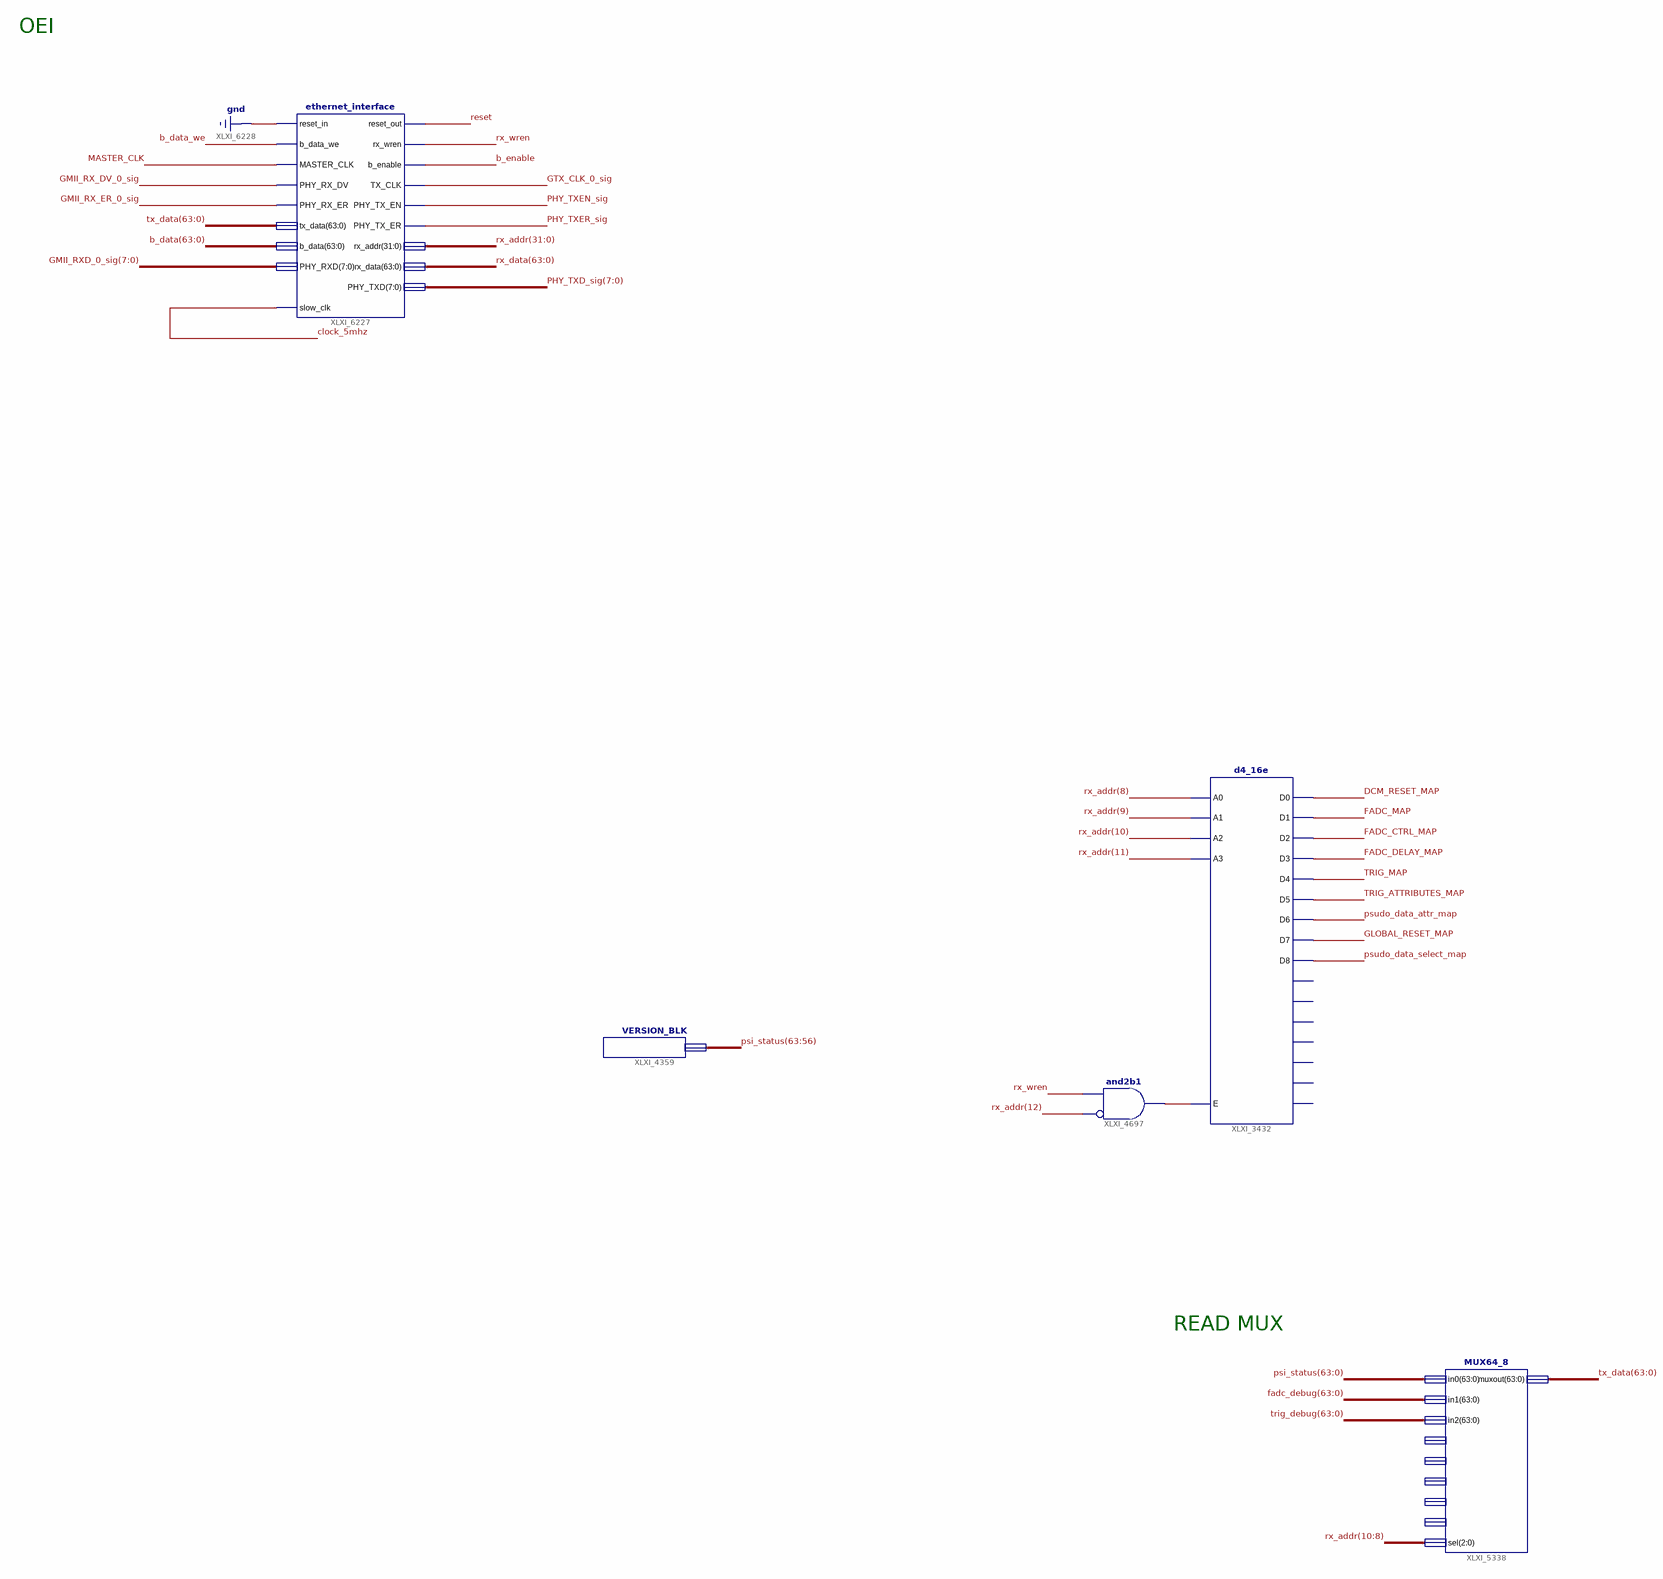
[diagram p0: schematic sheet 1]
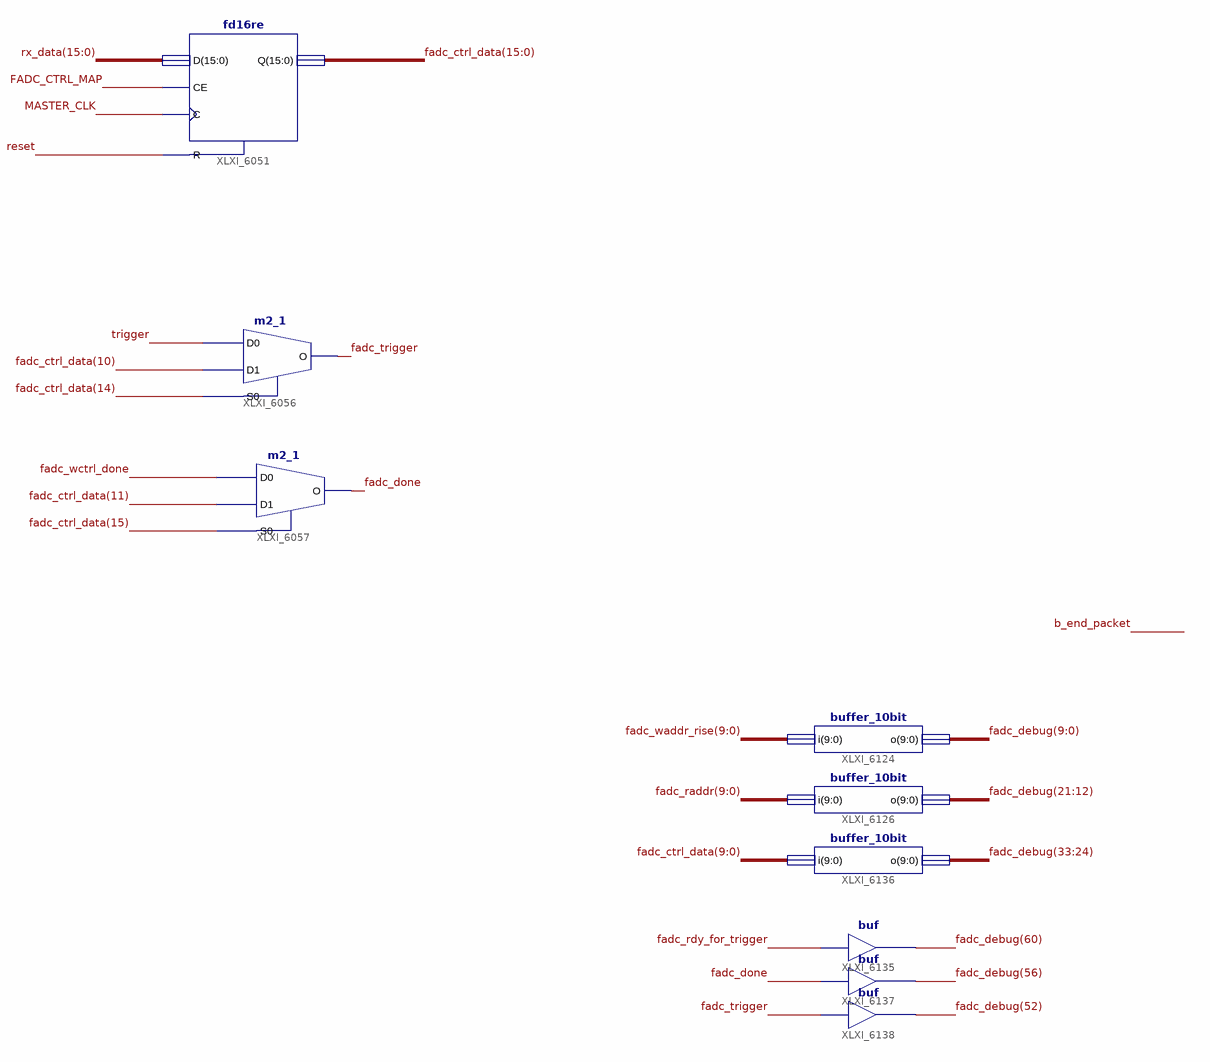
[diagram p1: schematic sheet 2]
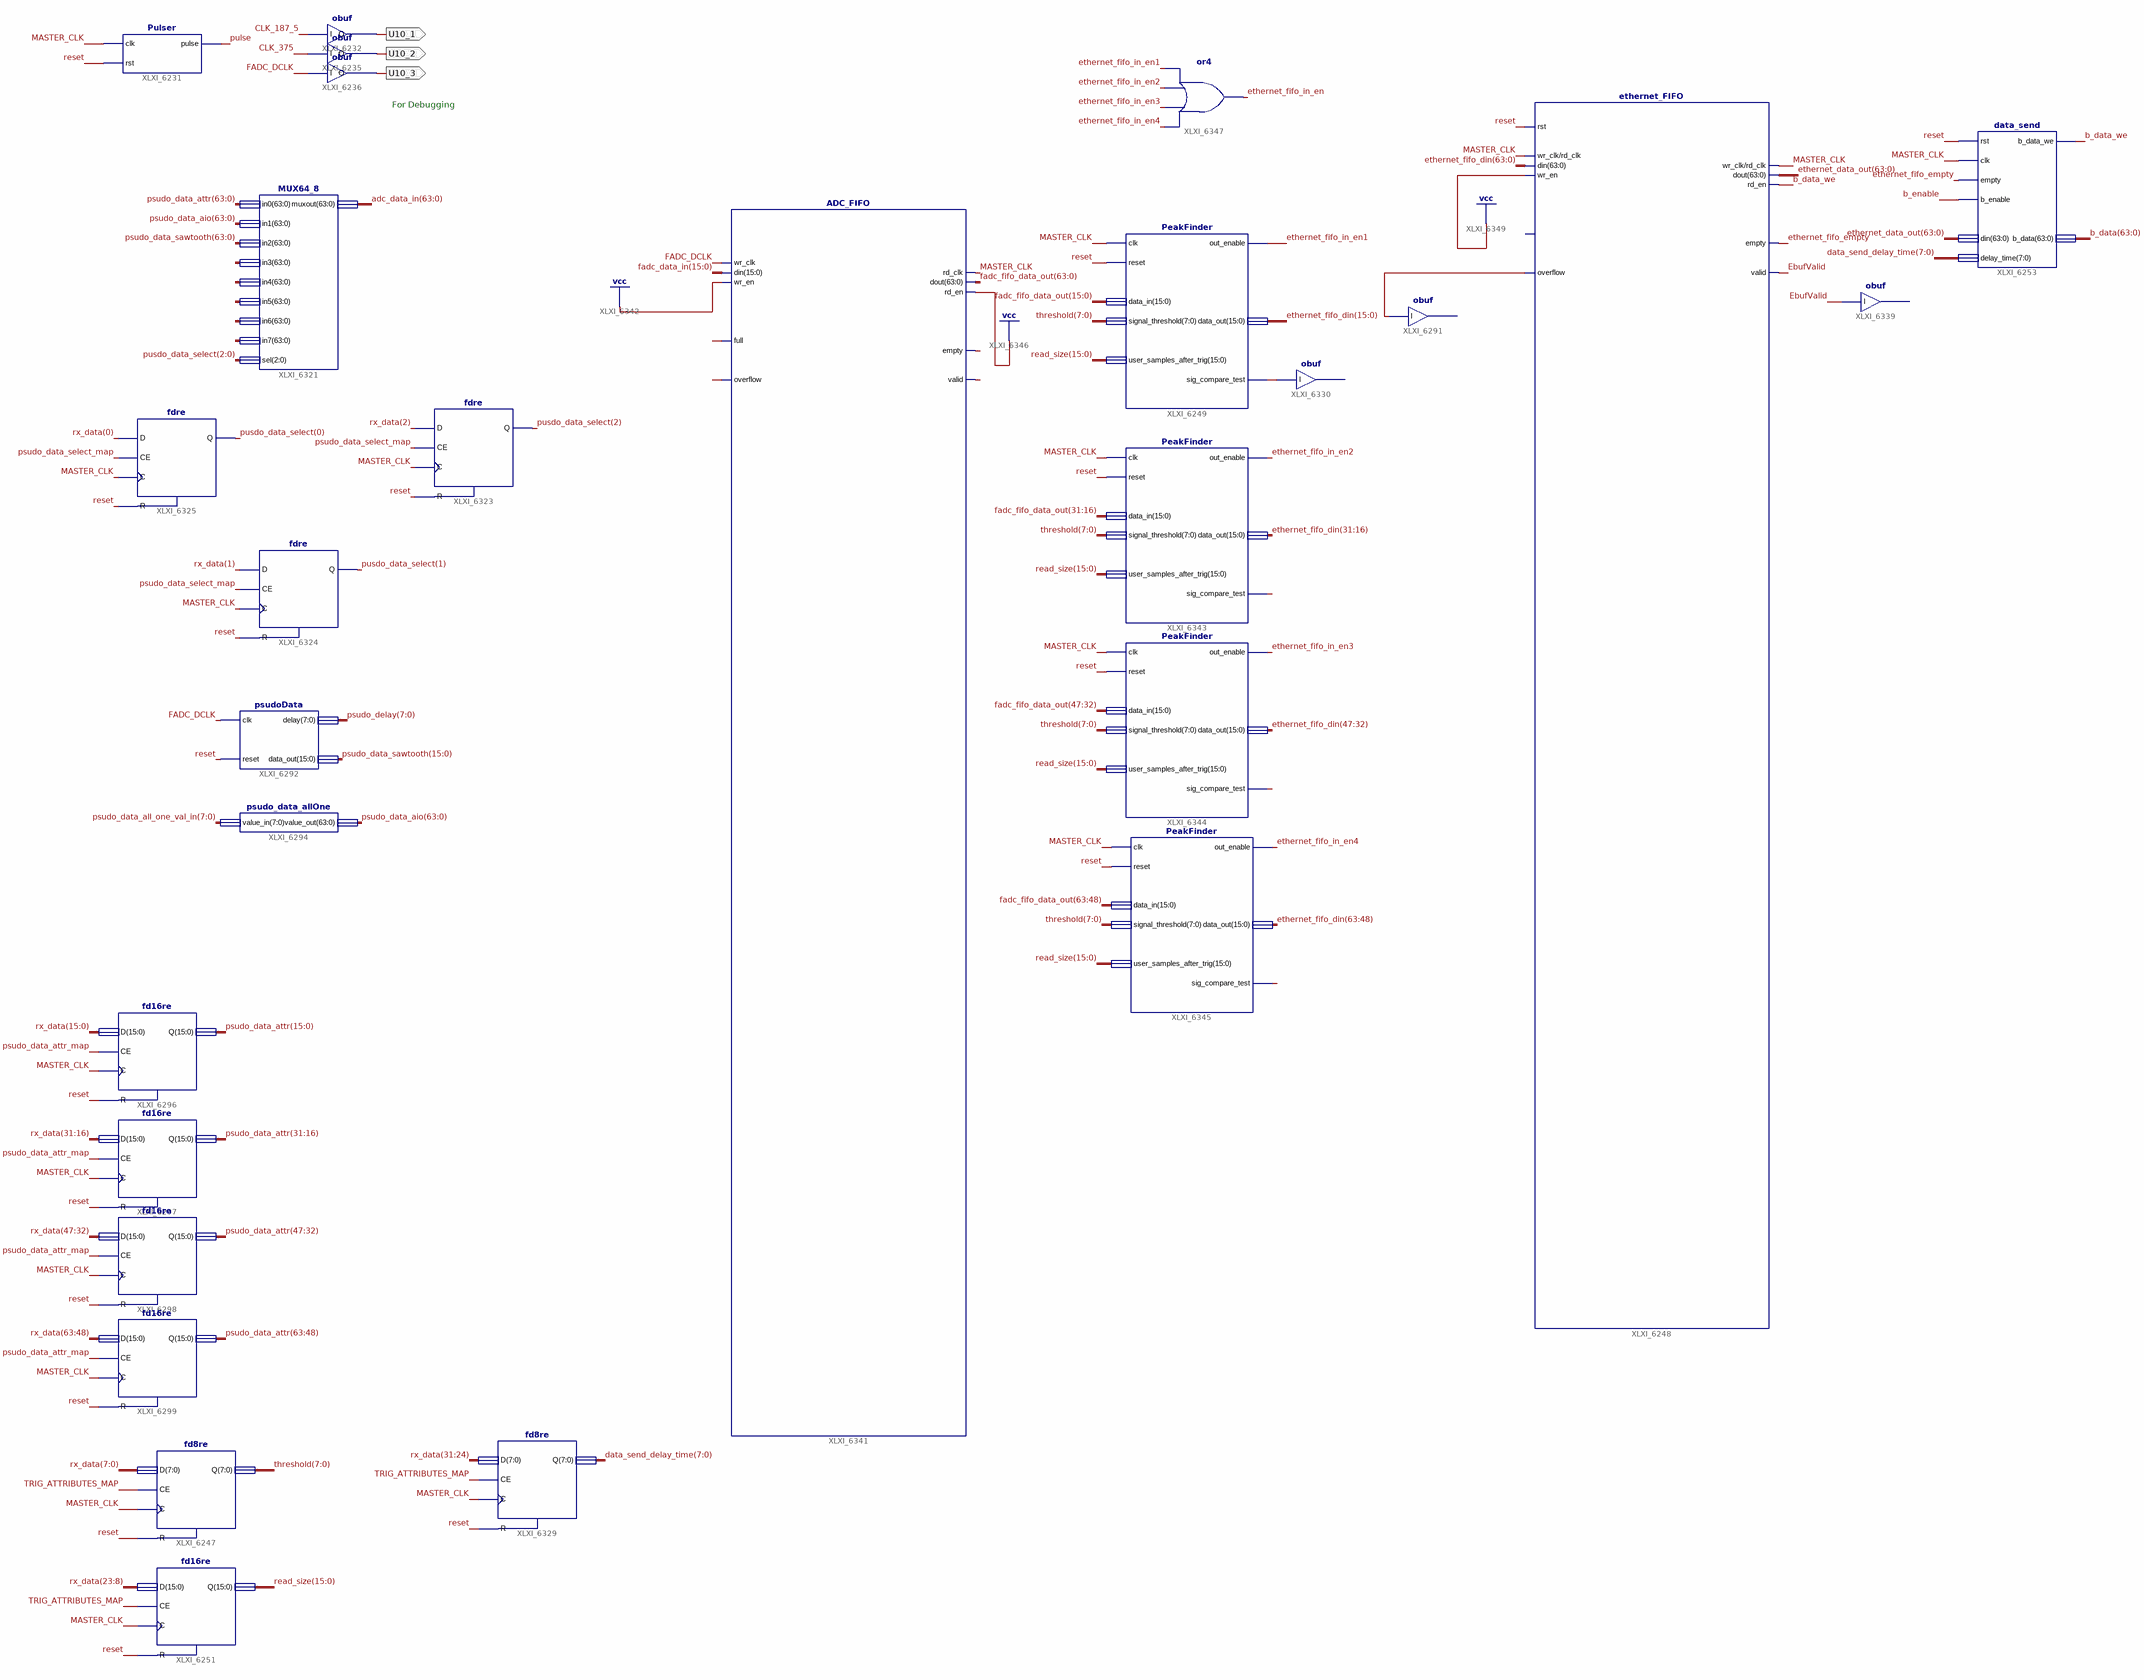
[diagram p2: schematic sheet 3]
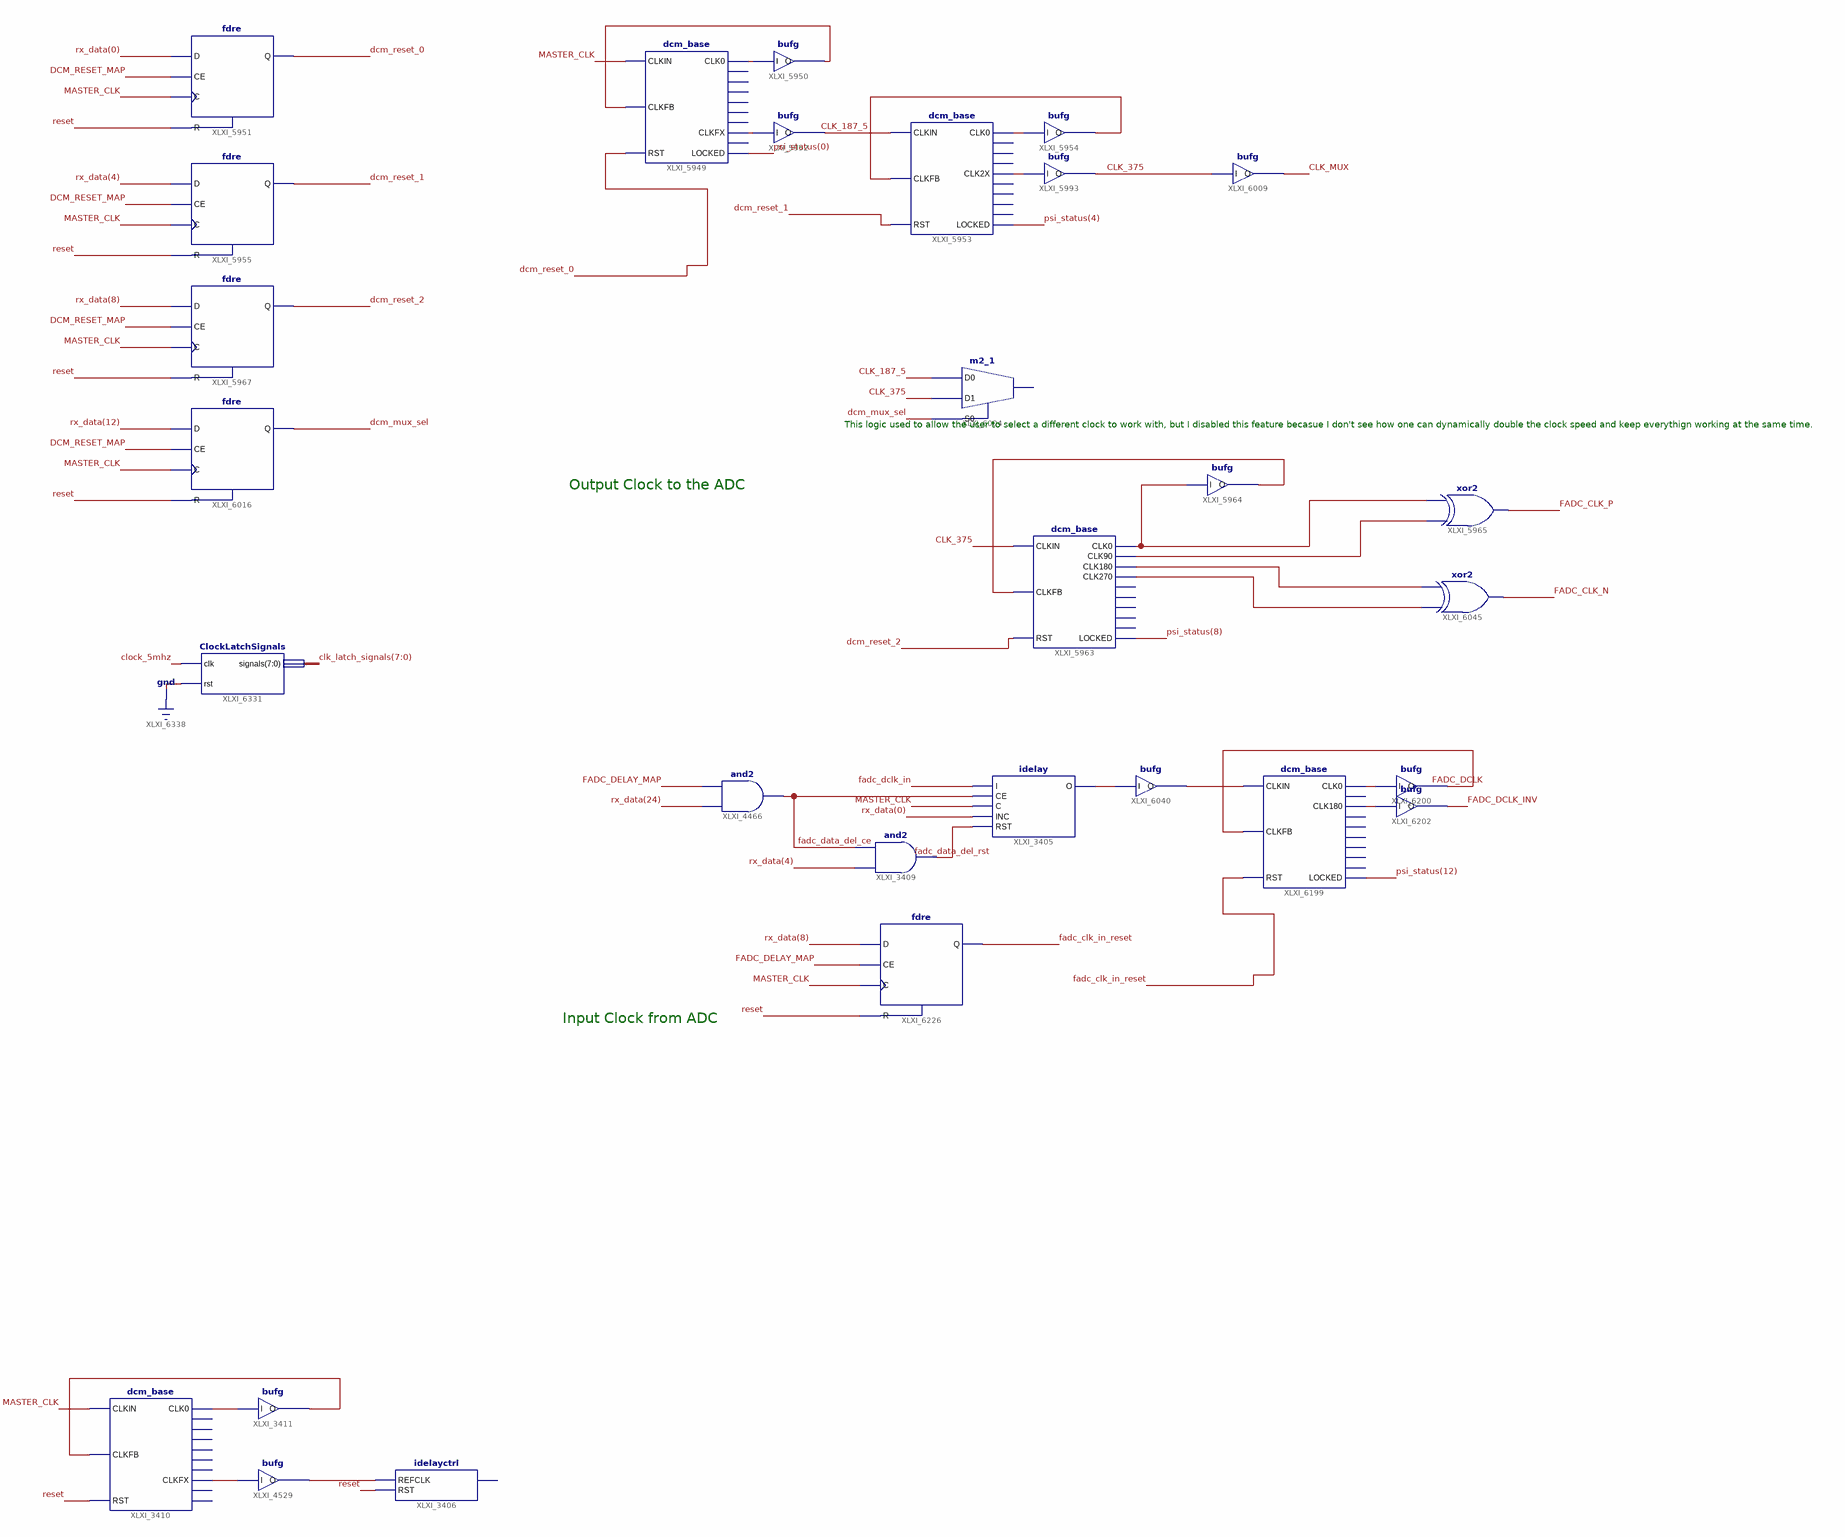
[diagram p3: schematic sheet 4]
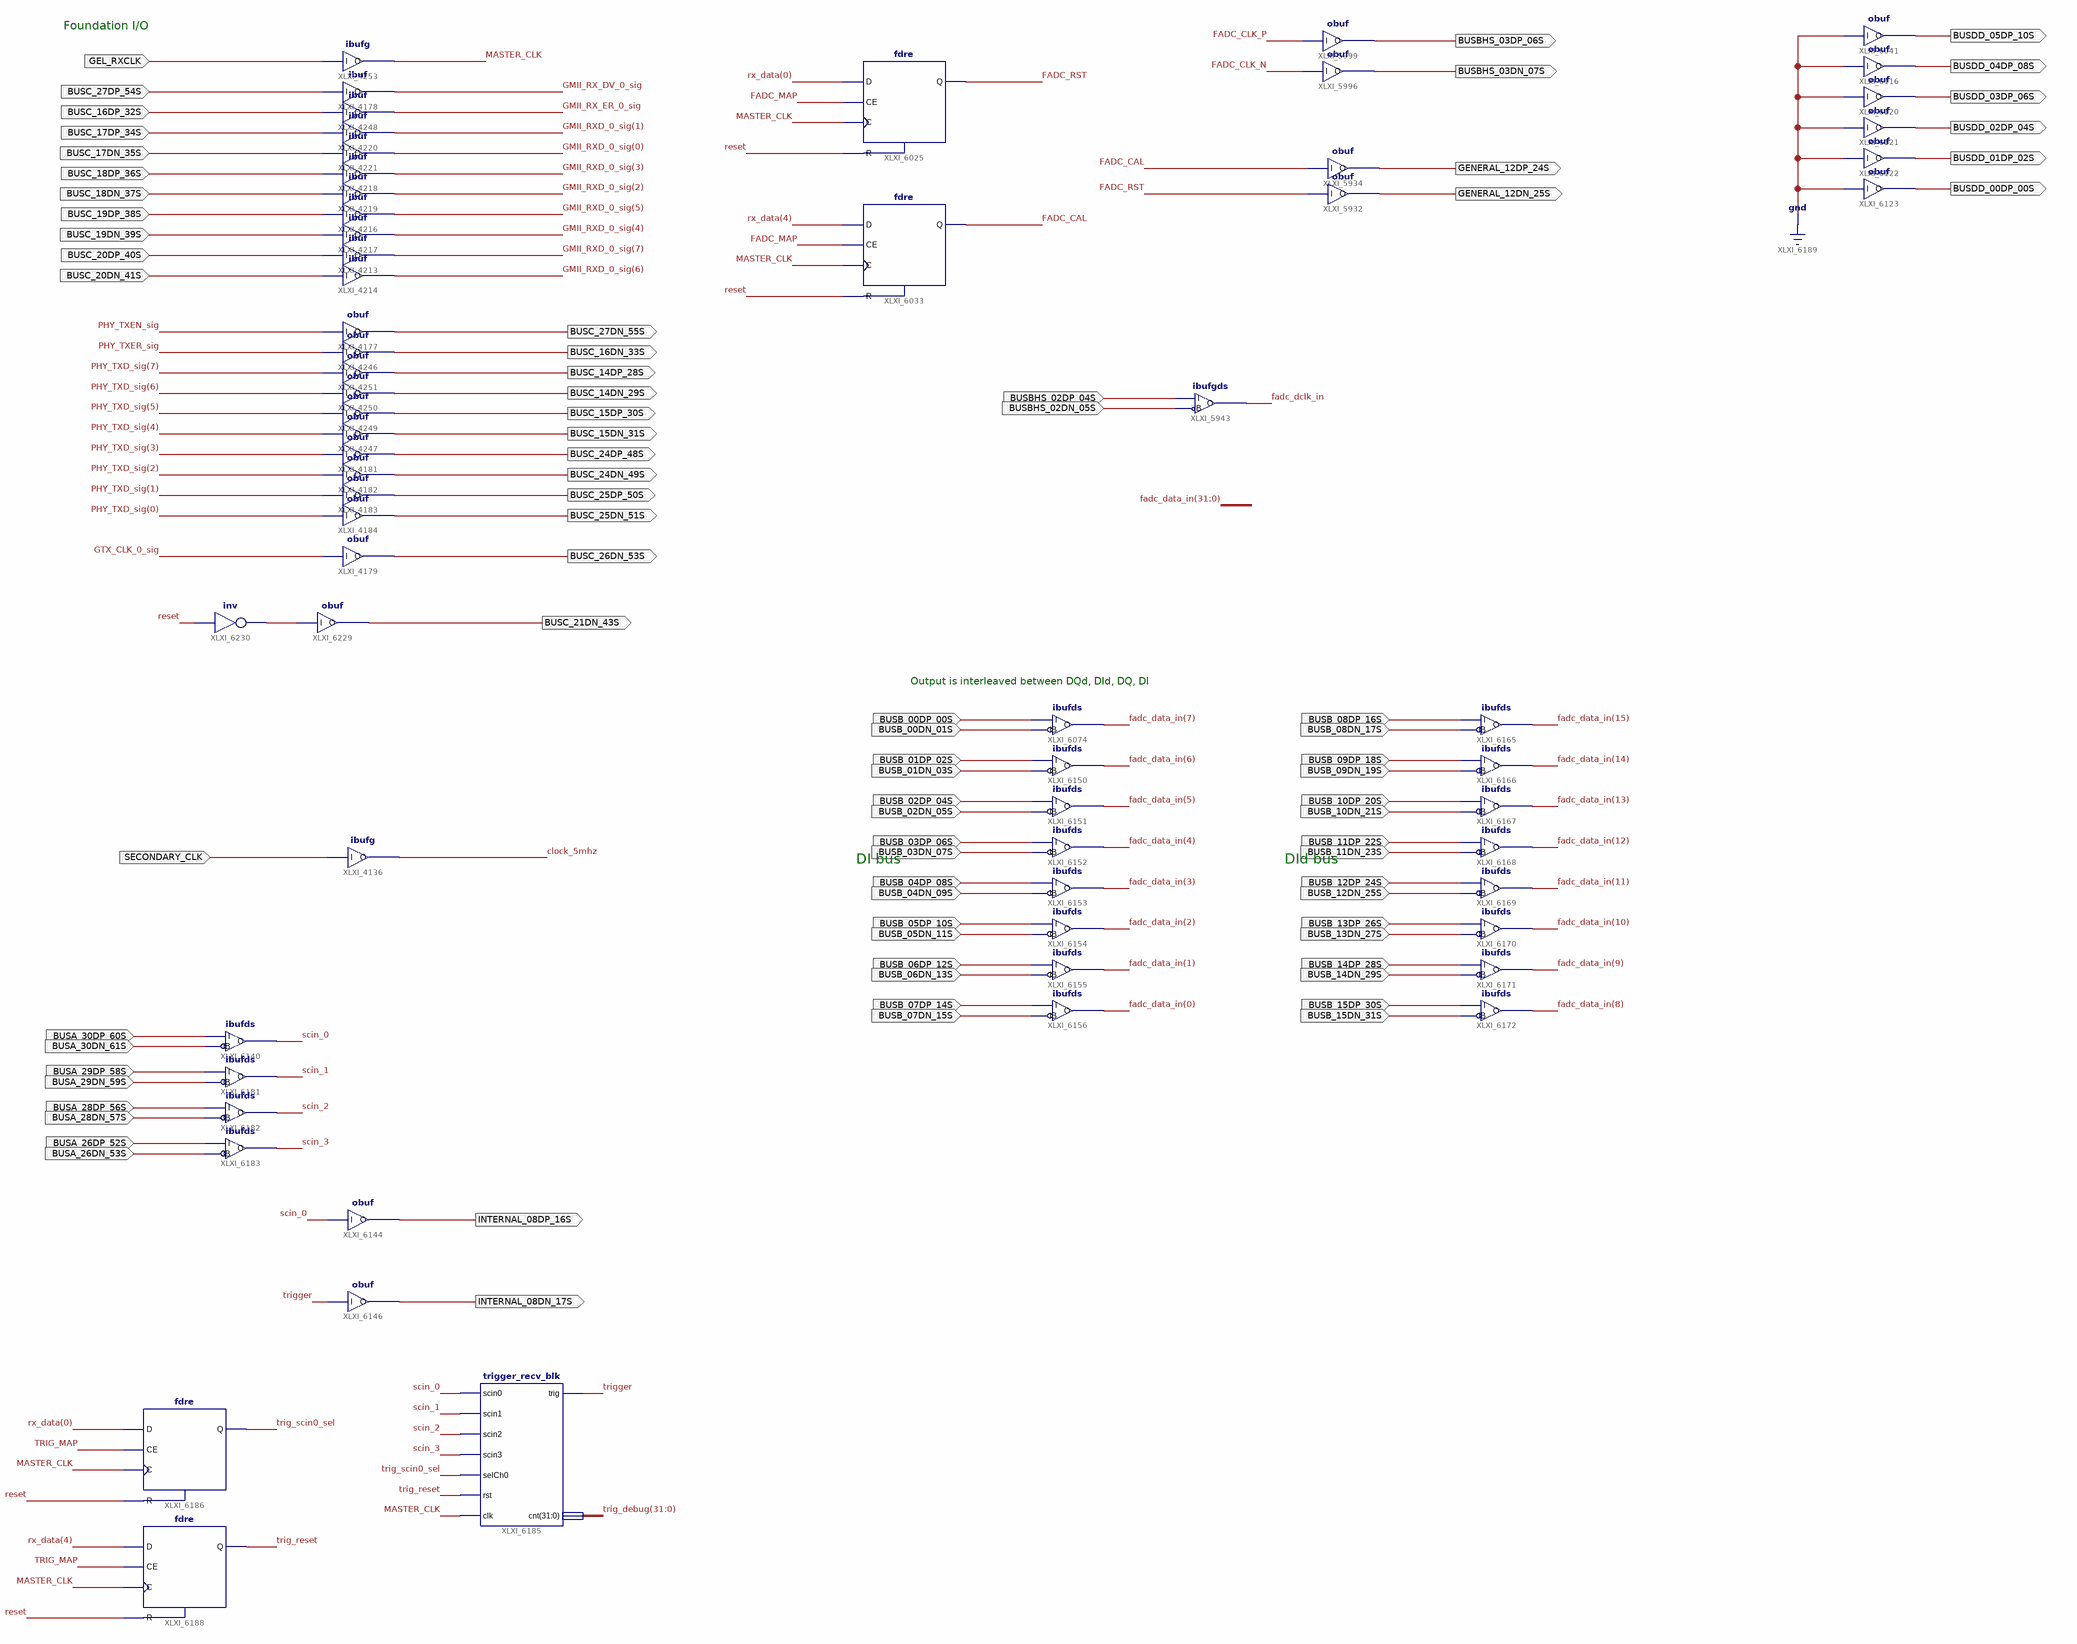
[diagram p4: schematic sheet 5]
// Xilinx ISE schematic TOP_LEVEL.sch (virtex4) as structural Verilog: 134 symbols, 81 ports
module TOP_LEVEL (
  input  BUSC_16DP_32S,
  input  SECONDARY_CLK,
  input  BUSC_20DN_41S,
  input  BUSC_19DN_39S,
  input  BUSC_20DP_40S,
  input  BUSC_19DP_38S,
  input  BUSC_18DP_36S,
  input  BUSC_18DN_37S,
  input  BUSC_17DN_35S,
  input  BUSC_17DP_34S,
  input  BUSC_27DP_54S,
  input  GEL_RXCLK,
  input  BUSBHS_02DP_04S,
  input  BUSBHS_02DN_05S,
  input  BUSB_00DP_00S,
  input  BUSB_00DN_01S,
  input  BUSB_01DP_02S,
  input  BUSB_01DN_03S,
  input  BUSB_02DP_04S,
  input  BUSB_02DN_05S,
  input  BUSB_03DP_06S,
  input  BUSB_03DN_07S,
  input  BUSB_04DP_08S,
  input  BUSB_05DP_10S,
  input  BUSB_05DN_11S,
  input  BUSB_06DP_12S,
  input  BUSB_06DN_13S,
  input  BUSB_07DP_14S,
  input  BUSB_07DN_15S,
  input  BUSB_04DN_09S,
  input  BUSB_08DP_16S,
  input  BUSB_08DN_17S,
  input  BUSB_09DP_18S,
  input  BUSB_09DN_19S,
  input  BUSB_10DP_20S,
  input  BUSB_10DN_21S,
  input  BUSB_11DP_22S,
  input  BUSB_11DN_23S,
  input  BUSB_12DP_24S,
  input  BUSB_12DN_25S,
  input  BUSB_13DP_26S,
  input  BUSB_13DN_27S,
  input  BUSB_14DP_28S,
  input  BUSB_14DN_29S,
  input  BUSB_15DP_30S,
  input  BUSB_15DN_31S,
  input  BUSA_30DP_60S,
  input  BUSA_30DN_61S,
  input  BUSA_29DP_58S,
  input  BUSA_29DN_59S,
  input  BUSA_28DP_56S,
  input  BUSA_28DN_57S,
  input  BUSA_26DP_52S,
  input  BUSA_26DN_53S,
  output BUSC_25DN_51S,
  output BUSC_25DP_50S,
  output BUSC_24DN_49S,
  output BUSC_24DP_48S,
  output BUSC_15DN_31S,
  output BUSC_15DP_30S,
  output BUSC_14DN_29S,
  output BUSC_14DP_28S,
  output BUSC_16DN_33S,
  output BUSC_27DN_55S,
  output BUSC_26DN_53S,
  output GENERAL_12DP_24S,
  output BUSBHS_03DP_06S,
  output BUSBHS_03DN_07S,
  output GENERAL_12DN_25S,
  output INTERNAL_08DP_16S,
  output INTERNAL_08DN_17S,
  output BUSDD_05DP_10S,
  output BUSDD_04DP_08S,
  output BUSDD_03DP_06S,
  output BUSDD_02DP_04S,
  output BUSDD_01DP_02S,
  output BUSDD_00DP_00S,
  output BUSC_21DN_43S,
  output U10_1,
  output U10_2,
  output U10_3
);

  wire b_data_we, b_enable, CLK_187_5, CLK_375, CLK_MUX, clock_5mhz, dcm_mux_sel, dcm_reset_0, dcm_reset_1,
       dcm_reset_2, DCM_RESET_MAP, EbufValid, ethernet_fifo_empty, ethernet_fifo_in_en, ethernet_fifo_in_en1,
       ethernet_fifo_in_en2, ethernet_fifo_in_en3, ethernet_fifo_in_en4, ethernet_overflow, FADC_CAL,
       fadc_clk_in_reset, FADC_CLK_N, FADC_CLK_P, FADC_CTRL_MAP, fadc_data_del_ce, fadc_data_del_rst,
       FADC_DCLK, fadc_dclk_in, FADC_DCLK_INV, FADC_DELAY_MAP, fadc_done, FADC_MAP, fadc_rdy_for_trigger,
       FADC_RST, fadc_trigger, fadc_wctrl_done, GLOBAL_RESET_MAP, GMII_RX_DV_0_sig, GMII_RX_ER_0_sig,
       GTX_CLK_0_sig, MASTER_CLK, PHY_TXEN_sig, PHY_TXER_sig, psudo_data_attr_map, psudo_data_select_map,
       pulse, reset, rx_wren, scin_0, scin_1, scin_2, scin_3, TRIG_ATTRIBUTES_MAP, TRIG_MAP, trig_reset,
       trig_scin0_sel, trigger, XLXN_12220, XLXN_12229, XLXN_12257, XLXN_12617, XLXN_12660, XLXN_12661,
       XLXN_12669, XLXN_12671, XLXN_12672, XLXN_12697, XLXN_12781, XLXN_12783, XLXN_12923, XLXN_12930,
       XLXN_12931, XLXN_15064, XLXN_15075, XLXN_15087, XLXN_15092, XLXN_15130, XLXN_15150, XLXN_15485,
       XLXN_15524, XLXN_15525, XLXN_15531, XLXN_15532, XLXN_15552, XLXN_15554, XLXN_15557;
  wire [2:0] pusdo_data_select;
  wire [7:0] clk_latch_signals, data_send_delay_time, GMII_RXD_0_sig, PHY_TXD_sig, psudo_data_all_one_val_in,
       psudo_delay, threshold;
  wire [9:0] fadc_raddr, fadc_waddr_rise;
  wire [15:0] fadc_ctrl_data, fadc_data_in, read_size;
  wire [31:0] rx_addr;
  wire [63:0] adc_data_in, b_data, ethernet_data_out, ethernet_fifo_din, fadc_debug, fadc_fifo_data_out,
       psi_status, psudo_data_aio, psudo_data_attr, psudo_data_sawtooth, rx_data, trig_debug, tx_data,
       XLXN_15479, XLXN_15480, XLXN_15481, XLXN_15483, XLXN_15484;

  ibuf XLXI_4248 (.I(BUSC_16DP_32S), .O(GMII_RX_ER_0_sig));
  ibufg XLXI_4136 (.I(SECONDARY_CLK), .O(clock_5mhz));
  obuf XLXI_4181 (.I(PHY_TXD_sig[3]), .O(BUSC_24DP_48S));
  obuf XLXI_4182 (.I(PHY_TXD_sig[2]), .O(BUSC_24DN_49S));
  obuf XLXI_4183 (.I(PHY_TXD_sig[1]), .O(BUSC_25DP_50S));
  obuf XLXI_4184 (.I(PHY_TXD_sig[0]), .O(BUSC_25DN_51S));
  obuf XLXI_4247 (.I(PHY_TXD_sig[4]), .O(BUSC_15DN_31S));
  obuf XLXI_4249 (.I(PHY_TXD_sig[5]), .O(BUSC_15DP_30S));
  obuf XLXI_4250 (.I(PHY_TXD_sig[6]), .O(BUSC_14DN_29S));
  obuf XLXI_4251 (.I(PHY_TXD_sig[7]), .O(BUSC_14DP_28S));
  obuf XLXI_4246 (.I(PHY_TXER_sig), .O(BUSC_16DN_33S));
  ibuf XLXI_4213 (.I(BUSC_20DP_40S), .O(GMII_RXD_0_sig[7]));
  ibuf XLXI_4214 (.I(BUSC_20DN_41S), .O(GMII_RXD_0_sig[6]));
  ibuf XLXI_4216 (.I(BUSC_19DP_38S), .O(GMII_RXD_0_sig[5]));
  ibuf XLXI_4217 (.I(BUSC_19DN_39S), .O(GMII_RXD_0_sig[4]));
  ibuf XLXI_4218 (.I(BUSC_18DP_36S), .O(GMII_RXD_0_sig[3]));
  ibuf XLXI_4219 (.I(BUSC_18DN_37S), .O(GMII_RXD_0_sig[2]));
  ibuf XLXI_4220 (.I(BUSC_17DP_34S), .O(GMII_RXD_0_sig[1]));
  ibuf XLXI_4221 (.I(BUSC_17DN_35S), .O(GMII_RXD_0_sig[0]));
  obuf XLXI_4177 (.I(PHY_TXEN_sig), .O(BUSC_27DN_55S));
  ibuf XLXI_4178 (.I(BUSC_27DP_54S), .O(GMII_RX_DV_0_sig));
  ibufg XLXI_4253 (.I(GEL_RXCLK), .O(MASTER_CLK));
  obuf XLXI_4179 (.I(GTX_CLK_0_sig), .O(BUSC_26DN_53S));
  VERSION_BLK XLXI_4359 (.version(psi_status[63:56]));
  d4_16e XLXI_3432 (
    .A0(rx_addr[8]), .A1(rx_addr[9]), .A2(rx_addr[10]), .A3(rx_addr[11]), .E(XLXN_12617), .D0(DCM_RESET_MAP),
    .D1(FADC_MAP), .D2(FADC_CTRL_MAP), .D3(FADC_DELAY_MAP), .D4(TRIG_MAP), .D5(TRIG_ATTRIBUTES_MAP),
    .D6(psudo_data_attr_map), .D7(GLOBAL_RESET_MAP), .D8(psudo_data_select_map));  // open: D10, D11, D12, D13, D14, D15, D9
  and XLXI_4697 (XLXN_12617, ~rx_addr[12], rx_wren);  // and2b1
  MUX64_8 XLXI_5338 (
    .in0(psi_status), .in1(fadc_debug), .in2(trig_debug), .sel(rx_addr[10:8]), .muxout(tx_data));  // open: in3, in4, in5, in6, in7
  fdre XLXI_5951 (.C(MASTER_CLK), .CE(DCM_RESET_MAP), .D(rx_data[0]), .R(reset), .Q(dcm_reset_0));
  dcm_base #(.CLKIN_PERIOD(8), .CLKFX_MULTIPLY(3), .CLKFX_DIVIDE(2)) XLXI_5949 (
    .CLKIN(MASTER_CLK), .CLKFB(XLXN_12661), .RST(dcm_reset_0), .CLK0(XLXN_12660), .CLKFX(XLXN_12669),
    .LOCKED(psi_status[0]));  // open: CLK90, CLK180, CLK270, CLK2X, CLK2X180, CLKDV, CLKFX180
  bufg XLXI_5950 (.I(XLXN_12660), .O(XLXN_12661));
  bufg XLXI_5952 (.I(XLXN_12669), .O(CLK_187_5));
  dcm_base #(.DLL_FREQUENCY_MODE("HIGH"), .DFS_FREQUENCY_MODE("HIGH"), .CLKIN_PERIOD(5.33333333)) XLXI_5953 (
    .CLKIN(CLK_187_5), .CLKFB(XLXN_12672), .RST(dcm_reset_1), .CLK0(XLXN_12671), .CLK2X(XLXN_12781),
    .LOCKED(psi_status[4]));  // open: CLK90, CLK180, CLK270, CLK2X180, CLKDV, CLKFX, CLKFX180
  bufg XLXI_5954 (.I(XLXN_12671), .O(XLXN_12672));
  fdre XLXI_5955 (.C(MASTER_CLK), .CE(DCM_RESET_MAP), .D(rx_data[4]), .R(reset), .Q(dcm_reset_1));
  fdre XLXI_5967 (.C(MASTER_CLK), .CE(DCM_RESET_MAP), .D(rx_data[8]), .R(reset), .Q(dcm_reset_2));
  bufg XLXI_5993 (.I(XLXN_12781), .O(CLK_375));
  obuf #(.SLEW("FAST"), .CAPACITANCE("DONT_CARE")) XLXI_5996 (.I(FADC_CLK_N), .O(BUSBHS_03DN_07S));
  obuf #(.SLEW("FAST"), .CAPACITANCE("DONT_CARE")) XLXI_5999 (.I(FADC_CLK_P), .O(BUSBHS_03DP_06S));
  m2_1 XLXI_6004 (.D0(CLK_187_5), .D1(CLK_375), .S0(dcm_mux_sel));  // open: O
  dcm_base #(.DLL_FREQUENCY_MODE("HIGH"), .DFS_FREQUENCY_MODE("HIGH"), .CLKIN_PERIOD(2.66666667)) XLXI_5963 (
    .CLKIN(CLK_375), .CLKFB(XLXN_12923), .RST(dcm_reset_2), .CLK0(XLXN_12697), .CLK90(XLXN_12783),
    .CLK180(XLXN_12930), .CLK270(XLXN_12931), .LOCKED(psi_status[8]));  // open: CLK2X, CLK2X180, CLKDV, CLKFX, CLKFX180
  bufg XLXI_5964 (.I(XLXN_12697), .O(XLXN_12923));
  xor XLXI_5965 (FADC_CLK_P, XLXN_12783, XLXN_12697);
  fdre XLXI_6016 (.C(MASTER_CLK), .CE(DCM_RESET_MAP), .D(rx_data[12]), .R(reset), .Q(dcm_mux_sel));
  fdre XLXI_6025 (.C(MASTER_CLK), .CE(FADC_MAP), .D(rx_data[0]), .R(reset), .Q(FADC_RST));
  fdre XLXI_6033 (.C(MASTER_CLK), .CE(FADC_MAP), .D(rx_data[4]), .R(reset), .Q(FADC_CAL));
  ibufgds #(.DIFF_TERM("TRUE"), .CAPACITANCE("LOW")) XLXI_5943 (
    .I(BUSBHS_02DP_04S), .IB(BUSBHS_02DN_05S), .O(fadc_dclk_in));
  obuf XLXI_5934 (.I(FADC_CAL), .O(GENERAL_12DP_24S));
  obuf XLXI_5932 (.I(FADC_RST), .O(GENERAL_12DN_25S));
  xor XLXI_6045 (FADC_CLK_N, XLXN_12931, XLXN_12930);
  fd16re XLXI_6051 (.C(MASTER_CLK), .CE(FADC_CTRL_MAP), .D(rx_data[15:0]), .R(reset), .Q(fadc_ctrl_data));
  m2_1 XLXI_6056 (.D0(trigger), .D1(fadc_ctrl_data[10]), .S0(fadc_ctrl_data[14]), .O(fadc_trigger));
  m2_1 XLXI_6057 (.D0(fadc_wctrl_done), .D1(fadc_ctrl_data[11]), .S0(fadc_ctrl_data[15]), .O(fadc_done));
  ibufds #(.DIFF_TERM("TRUE"), .CAPACITANCE("DONT_CARE")) XLXI_6074 (
    .I(BUSB_00DP_00S), .IB(BUSB_00DN_01S), .O(fadc_data_in[7]));
  dcm_base #(.CLKIN_PERIOD(8), .CLKFX_MULTIPLY(8), .CLKFX_DIVIDE(5)) XLXI_3410 (
    .CLKIN(MASTER_CLK), .CLKFB(XLXN_12229), .RST(reset), .CLK0(XLXN_12220), .CLKFX(XLXN_12257));  // open: CLK90, CLK180, CLK270, CLK2X, CLK2X180, CLKDV, CLKFX180, LOCKED
  bufg XLXI_3411 (.I(XLXN_12220), .O(XLXN_12229));
  idelayctrl XLXI_3406 (.REFCLK(XLXN_15064), .RST(reset));  // open: RDY
  bufg XLXI_4529 (.I(XLXN_12257), .O(XLXN_15064));
  ibufds #(.DIFF_TERM("TRUE"), .CAPACITANCE("DONT_CARE")) XLXI_6140 (.I(BUSA_30DP_60S), .IB(BUSA_30DN_61S), .O(scin_0));
  obuf XLXI_6144 (.I(scin_0), .O(INTERNAL_08DP_16S));
  obuf XLXI_6146 (.I(trigger), .O(INTERNAL_08DN_17S));
  ibufds #(.DIFF_TERM("TRUE"), .CAPACITANCE("DONT_CARE")) XLXI_6150 (
    .I(BUSB_01DP_02S), .IB(BUSB_01DN_03S), .O(fadc_data_in[6]));
  ibufds #(.DIFF_TERM("TRUE"), .CAPACITANCE("DONT_CARE")) XLXI_6151 (
    .I(BUSB_02DP_04S), .IB(BUSB_02DN_05S), .O(fadc_data_in[5]));
  ibufds #(.DIFF_TERM("TRUE"), .CAPACITANCE("DONT_CARE")) XLXI_6152 (
    .I(BUSB_03DP_06S), .IB(BUSB_03DN_07S), .O(fadc_data_in[4]));
  ibufds #(.DIFF_TERM("TRUE"), .CAPACITANCE("DONT_CARE")) XLXI_6153 (
    .I(BUSB_04DP_08S), .IB(BUSB_04DN_09S), .O(fadc_data_in[3]));
  ibufds #(.DIFF_TERM("TRUE"), .CAPACITANCE("DONT_CARE")) XLXI_6154 (
    .I(BUSB_05DP_10S), .IB(BUSB_05DN_11S), .O(fadc_data_in[2]));
  ibufds #(.DIFF_TERM("TRUE"), .CAPACITANCE("DONT_CARE")) XLXI_6155 (
    .I(BUSB_06DP_12S), .IB(BUSB_06DN_13S), .O(fadc_data_in[1]));
  ibufds #(.DIFF_TERM("TRUE"), .CAPACITANCE("DONT_CARE")) XLXI_6156 (
    .I(BUSB_07DP_14S), .IB(BUSB_07DN_15S), .O(fadc_data_in[0]));
  ibufds #(.DIFF_TERM("TRUE"), .CAPACITANCE("DONT_CARE")) XLXI_6165 (
    .I(BUSB_08DP_16S), .IB(BUSB_08DN_17S), .O(fadc_data_in[15]));
  ibufds #(.DIFF_TERM("TRUE"), .CAPACITANCE("DONT_CARE")) XLXI_6166 (
    .I(BUSB_09DP_18S), .IB(BUSB_09DN_19S), .O(fadc_data_in[14]));
  ibufds #(.DIFF_TERM("TRUE"), .CAPACITANCE("DONT_CARE")) XLXI_6167 (
    .I(BUSB_10DP_20S), .IB(BUSB_10DN_21S), .O(fadc_data_in[13]));
  ibufds #(.DIFF_TERM("TRUE"), .CAPACITANCE("DONT_CARE")) XLXI_6168 (
    .I(BUSB_11DP_22S), .IB(BUSB_11DN_23S), .O(fadc_data_in[12]));
  ibufds #(.DIFF_TERM("TRUE"), .CAPACITANCE("DONT_CARE")) XLXI_6169 (
    .I(BUSB_12DP_24S), .IB(BUSB_12DN_25S), .O(fadc_data_in[11]));
  ibufds #(.DIFF_TERM("TRUE"), .CAPACITANCE("DONT_CARE")) XLXI_6170 (
    .I(BUSB_13DP_26S), .IB(BUSB_13DN_27S), .O(fadc_data_in[10]));
  ibufds #(.DIFF_TERM("TRUE"), .CAPACITANCE("DONT_CARE")) XLXI_6171 (
    .I(BUSB_14DP_28S), .IB(BUSB_14DN_29S), .O(fadc_data_in[9]));
  ibufds #(.DIFF_TERM("TRUE"), .CAPACITANCE("DONT_CARE")) XLXI_6172 (
    .I(BUSB_15DP_30S), .IB(BUSB_15DN_31S), .O(fadc_data_in[8]));
  ibufds #(.DIFF_TERM("TRUE"), .CAPACITANCE("DONT_CARE")) XLXI_6181 (.I(BUSA_29DP_58S), .IB(BUSA_29DN_59S), .O(scin_1));
  ibufds #(.DIFF_TERM("TRUE"), .CAPACITANCE("DONT_CARE")) XLXI_6182 (.I(BUSA_28DP_56S), .IB(BUSA_28DN_57S), .O(scin_2));
  ibufds #(.DIFF_TERM("TRUE"), .CAPACITANCE("DONT_CARE")) XLXI_6183 (.I(BUSA_26DP_52S), .IB(BUSA_26DN_53S), .O(scin_3));
  trigger_recv_blk XLXI_6185 (
    .scin0(scin_0), .scin1(scin_1), .scin2(scin_2), .scin3(scin_3), .selCh0(trig_scin0_sel),
    .rst(trig_reset), .clk(MASTER_CLK), .trig(trigger), .cnt(trig_debug[31:0]));
  fdre XLXI_6186 (.C(MASTER_CLK), .CE(TRIG_MAP), .D(rx_data[0]), .R(reset), .Q(trig_scin0_sel));
  fdre XLXI_6188 (.C(MASTER_CLK), .CE(TRIG_MAP), .D(rx_data[4]), .R(reset), .Q(trig_reset));
  buffer_10bit XLXI_6126 (.i(fadc_raddr), .o(fadc_debug[21:12]));
  buffer_10bit XLXI_6136 (.i(fadc_ctrl_data[9:0]), .o(fadc_debug[33:24]));
  buf XLXI_6137 (fadc_debug[56], fadc_done);
  buf XLXI_6138 (fadc_debug[52], fadc_trigger);
  buf XLXI_6135 (fadc_debug[60], fadc_rdy_for_trigger);
  buffer_10bit XLXI_6124 (.i(fadc_waddr_rise), .o(fadc_debug[9:0]));
  obuf #(.SLEW("FAST")) XLXI_6041 (.I(1'b0), .O(BUSDD_05DP_10S));
  obuf #(.SLEW("FAST")) XLXI_6116 (.I(1'b0), .O(BUSDD_04DP_08S));
  obuf #(.SLEW("FAST")) XLXI_6120 (.I(1'b0), .O(BUSDD_03DP_06S));
  obuf #(.SLEW("FAST")) XLXI_6121 (.I(1'b0), .O(BUSDD_02DP_04S));
  obuf #(.SLEW("FAST")) XLXI_6122 (.I(1'b0), .O(BUSDD_01DP_02S));
  obuf #(.SLEW("FAST")) XLXI_6123 (.I(1'b0), .O(BUSDD_00DP_00S));
  dcm_base #(.DLL_FREQUENCY_MODE("HIGH"), .DFS_FREQUENCY_MODE("HIGH"), .CLKIN_PERIOD(5.33333333)) XLXI_6199 (
    .CLKIN(XLXN_15130), .CLKFB(FADC_DCLK), .RST(fadc_clk_in_reset), .CLK0(XLXN_15087), .CLK180(XLXN_15092),
    .LOCKED(psi_status[12]));  // open: CLK90, CLK270, CLK2X, CLK2X180, CLKDV, CLKFX, CLKFX180
  bufg XLXI_6200 (.I(XLXN_15087), .O(FADC_DCLK));
  bufg XLXI_6202 (.I(XLXN_15092), .O(FADC_DCLK_INV));
  idelay #(.IOBDELAY_TYPE("VARIABLE")) XLXI_3405 (
    .I(fadc_dclk_in), .CE(fadc_data_del_ce), .C(MASTER_CLK), .INC(rx_data[0]), .RST(fadc_data_del_rst),
    .O(XLXN_15075));
  and XLXI_4466 (fadc_data_del_ce, rx_data[24], FADC_DELAY_MAP);
  and XLXI_3409 (fadc_data_del_rst, rx_data[4], fadc_data_del_ce);
  bufg XLXI_6040 (.I(XLXN_15075), .O(XLXN_15130));
  fdre XLXI_6226 (.C(MASTER_CLK), .CE(FADC_DELAY_MAP), .D(rx_data[8]), .R(reset), .Q(fadc_clk_in_reset));
  ethernet_interface XLXI_6227 (
    .reset_in(1'b0), .b_data_we(b_data_we), .MASTER_CLK(MASTER_CLK), .PHY_RX_DV(GMII_RX_DV_0_sig),
    .PHY_RX_ER(GMII_RX_ER_0_sig), .tx_data(tx_data), .b_data(b_data), .PHY_RXD(GMII_RXD_0_sig),
    .reset_out(reset), .rx_wren(rx_wren), .b_enable(b_enable), .TX_CLK(GTX_CLK_0_sig),
    .PHY_TX_EN(PHY_TXEN_sig), .PHY_TX_ER(PHY_TXER_sig), .rx_addr(rx_addr), .rx_data(rx_data),
    .PHY_TXD(PHY_TXD_sig), .slow_clk(clock_5mhz));
  obuf XLXI_6229 (.I(XLXN_15150), .O(BUSC_21DN_43S));
  not XLXI_6230 (XLXN_15150, reset);
  Pulser XLXI_6231 (.clk(MASTER_CLK), .rst(reset), .pulse(pulse));
  fd16re XLXI_6251 (.C(MASTER_CLK), .CE(TRIG_ATTRIBUTES_MAP), .D(rx_data[23:8]), .R(reset), .Q(read_size));
  fd8re XLXI_6247 (.C(MASTER_CLK), .CE(TRIG_ATTRIBUTES_MAP), .D(rx_data[7:0]), .R(reset), .Q(threshold));
  fd16re XLXI_6296 (.C(MASTER_CLK), .CE(psudo_data_attr_map), .D(rx_data[15:0]), .R(reset), .Q(psudo_data_attr[15:0]));
  fd16re XLXI_6297 (
    .C(MASTER_CLK), .CE(psudo_data_attr_map), .D(rx_data[31:16]), .R(reset), .Q(psudo_data_attr[31:16]));
  fd16re XLXI_6298 (
    .C(MASTER_CLK), .CE(psudo_data_attr_map), .D(rx_data[47:32]), .R(reset), .Q(psudo_data_attr[47:32]));
  fd16re XLXI_6299 (
    .C(MASTER_CLK), .CE(psudo_data_attr_map), .D(rx_data[63:48]), .R(reset), .Q(psudo_data_attr[63:48]));
  ethernet_FIFO XLXI_6248 (
    .rst(reset), .wr_clk(MASTER_CLK), .din(ethernet_fifo_din), .wr_en(1'b1), .overflow(ethernet_overflow),
    .rd_clk(MASTER_CLK), .dout(ethernet_data_out), .rd_en(b_data_we), .empty(ethernet_fifo_empty),
    .valid(EbufValid));  // open: full
  data_send XLXI_6253 (
    .rst(reset), .clk(MASTER_CLK), .empty(ethernet_fifo_empty), .b_enable(b_enable), .din(ethernet_data_out),
    .b_data_we(b_data_we), .b_data(b_data), .delay_time(data_send_delay_time));
  obuf XLXI_6291 (.I(ethernet_overflow));  // open: O
  obuf XLXI_6232 (.I(CLK_187_5), .O(U10_1));
  obuf XLXI_6235 (.I(CLK_375), .O(U10_2));
  obuf XLXI_6236 (.I(FADC_DCLK), .O(U10_3));
  fdre XLXI_6323 (.C(MASTER_CLK), .CE(psudo_data_select_map), .D(rx_data[2]), .R(reset), .Q(pusdo_data_select[2]));
  psudo_data_allOne XLXI_6294 (.value_in(psudo_data_all_one_val_in), .value_out(psudo_data_aio));
  psudoData XLXI_6292 (.clk(FADC_DCLK), .reset(reset), .delay(psudo_delay), .data_out(psudo_data_sawtooth[15:0]));
  fdre XLXI_6324 (.C(MASTER_CLK), .CE(psudo_data_select_map), .D(rx_data[1]), .R(reset), .Q(pusdo_data_select[1]));
  fdre XLXI_6325 (.C(MASTER_CLK), .CE(psudo_data_select_map), .D(rx_data[0]), .R(reset), .Q(pusdo_data_select[0]));
  fd8re XLXI_6329 (.C(MASTER_CLK), .CE(TRIG_ATTRIBUTES_MAP), .D(rx_data[31:24]), .R(reset), .Q(data_send_delay_time));
  PeakFinder XLXI_6249 (
    .clk(MASTER_CLK), .reset(reset), .data_in(fadc_fifo_data_out[15:0]), .signal_threshold(threshold),
    .user_samples_after_trig(read_size), .out_enable(ethernet_fifo_in_en1),
    .data_out(ethernet_fifo_din[15:0]), .sig_compare_test(XLXN_15485));
  MUX64_8 XLXI_6321 (
    .in0(psudo_data_attr), .in1(psudo_data_aio), .in2(psudo_data_sawtooth), .in3(XLXN_15479),
    .in4(XLXN_15480), .in5(XLXN_15481), .in6(XLXN_15483), .in7(XLXN_15484), .sel(pusdo_data_select),
    .muxout(adc_data_in));
  obuf XLXI_6330 (.I(XLXN_15485));  // open: O
  ClockLatchSignals XLXI_6331 (.clk(clock_5mhz), .rst(1'b0), .signals(clk_latch_signals));
  obuf XLXI_6339 (.I(EbufValid));  // open: O
  bufg XLXI_6009 (.I(CLK_375), .O(CLK_MUX));
  ADC_FIFO XLXI_6341 (
    .wr_clk(FADC_DCLK), .din(fadc_data_in), .wr_en(1'b1), .full(XLXN_15524), .overflow(XLXN_15525),
    .rd_clk(MASTER_CLK), .dout(fadc_fifo_data_out), .rd_en(1'b1), .empty(XLXN_15531), .valid(XLXN_15532));
  PeakFinder XLXI_6343 (
    .clk(MASTER_CLK), .reset(reset), .data_in(fadc_fifo_data_out[31:16]), .signal_threshold(threshold),
    .user_samples_after_trig(read_size), .out_enable(ethernet_fifo_in_en2),
    .data_out(ethernet_fifo_din[31:16]), .sig_compare_test(XLXN_15557));
  PeakFinder XLXI_6344 (
    .clk(MASTER_CLK), .reset(reset), .data_in(fadc_fifo_data_out[47:32]), .signal_threshold(threshold),
    .user_samples_after_trig(read_size), .out_enable(ethernet_fifo_in_en3),
    .data_out(ethernet_fifo_din[47:32]), .sig_compare_test(XLXN_15554));
  PeakFinder XLXI_6345 (
    .clk(MASTER_CLK), .reset(reset), .data_in(fadc_fifo_data_out[63:48]), .signal_threshold(threshold),
    .user_samples_after_trig(read_size), .out_enable(ethernet_fifo_in_en4),
    .data_out(ethernet_fifo_din[63:48]), .sig_compare_test(XLXN_15552));
  or XLXI_6347 (ethernet_fifo_in_en, ethernet_fifo_in_en4, ethernet_fifo_in_en3, ethernet_fifo_in_en2, ethernet_fifo_in_en1);

  // Notes on the sheet:
  //   OEI
  //   READ MUX
  //   For Debugging
  //   This logic used to allow the user to select a different clock to work with, but I disabled this feature becasue I don't see how one can dynamically double the clock speed and keep everythign working at the same time.
  //   Output Clock to the ADC
  //   Input Clock from ADC
  //   Foundation I/O
  //   Output is interleaved between DQd, DId, DQ, DI
  //   DI bus
  //   DId bus
endmodule
